# Altium schematic sheet Digital IO Protection.SchDoc: Digital IO Protection
size B; DrawnBy: Jasper Yun; SheetNumber: 6; SheetTotal: 11; Competition: SAC 2021; Subteam: Avionics; University: McGill University; Location: Montreal, Quebec; Project: Avionics Project Name; MRT: McGill Rocket Team
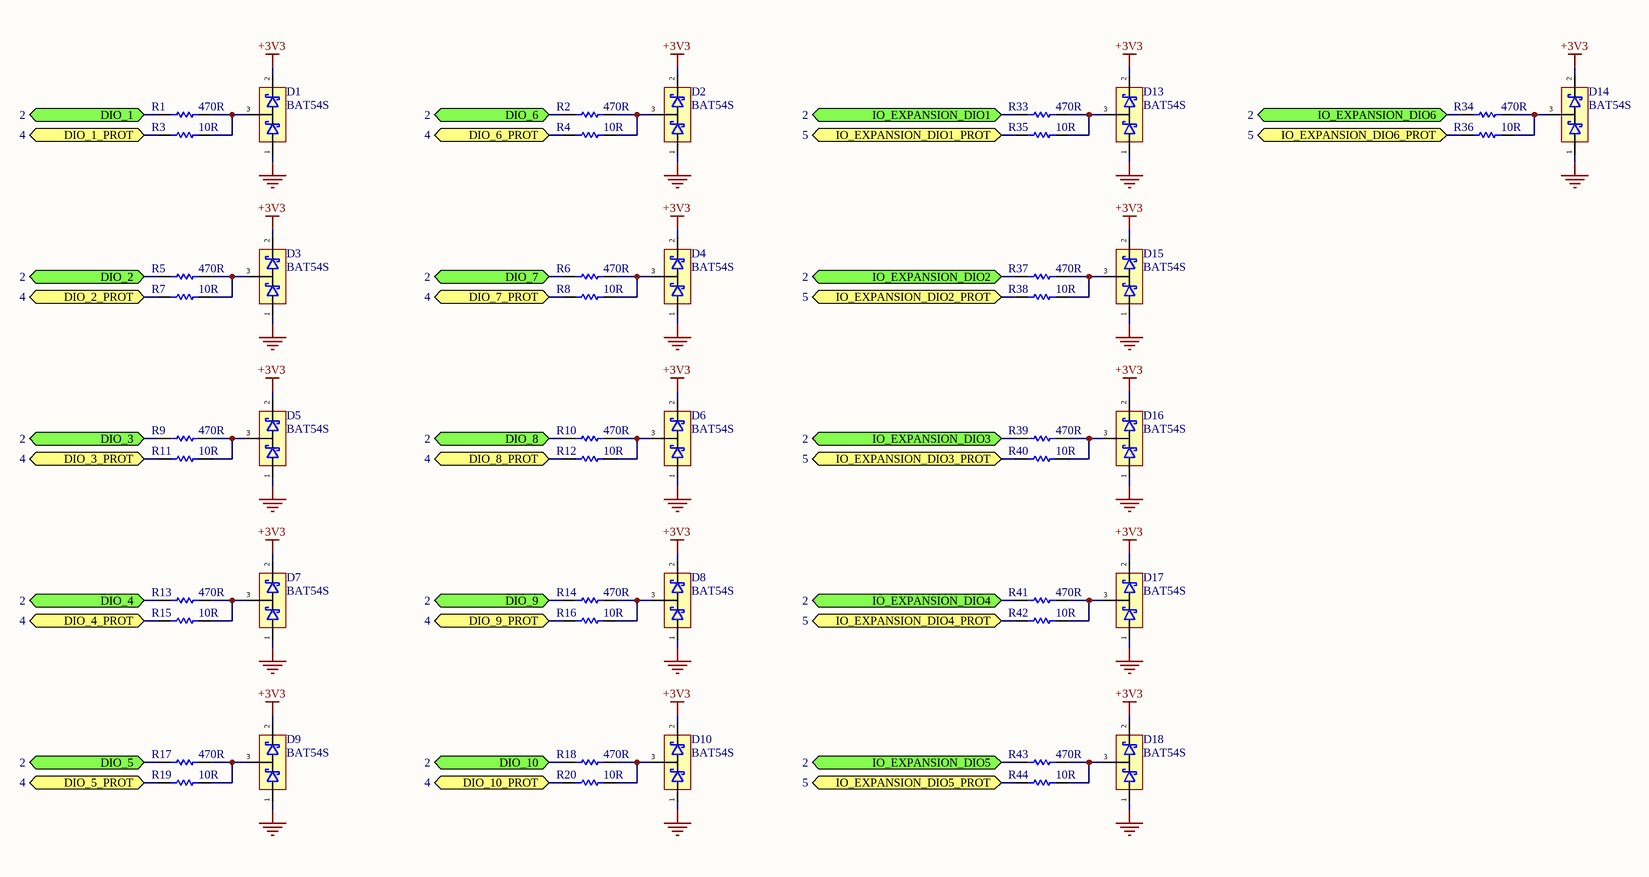
[diagram p0: Digital IO Protection.SchDoc]

## Parts
D1  BAT54S  [SOT23-3]
D2  BAT54S  [SOT23-3]
D3  BAT54S  [SOT23-3]
D4  BAT54S  [SOT23-3]
D5  BAT54S  [SOT23-3]
D6  BAT54S  [SOT23-3]
D7  BAT54S  [SOT23-3]
D8  BAT54S  [SOT23-3]
D9  BAT54S  [SOT23-3]
D10  BAT54S  [SOT23-3]
D13  BAT54S  [SOT23-3]
D14  BAT54S  [SOT23-3]
D15  BAT54S  [SOT23-3]
D16  BAT54S  [SOT23-3]
D17  BAT54S  [SOT23-3]
D18  BAT54S  [SOT23-3]
R1  470R  [0805 RES]
R2  470R  [0805 RES]
R3  10R  [0603 RES]
R4  10R  [0603 RES]
R5  470R  [0805 RES]
R6  470R  [0805 RES]
R7  10R  [0603 RES]
R8  10R  [0603 RES]
R9  470R  [0805 RES]
R10  470R  [0805 RES]
R11  10R  [0603 RES]
R12  10R  [0603 RES]
R13  470R  [0805 RES]
R14  470R  [0805 RES]
R15  10R  [0603 RES]
R16  10R  [0603 RES]
R17  470R  [0805 RES]
R18  470R  [0805 RES]
R19  10R  [0603 RES]
R20  10R  [0603 RES]
R33  470R  [0805 RES]
R34  470R  [0805 RES]
R35  10R  [0603 RES]
R36  10R  [0603 RES]
R37  470R  [0805 RES]
R38  10R  [0603 RES]
R39  470R  [0805 RES]
R40  10R  [0603 RES]
R41  470R  [0805 RES]
R42  10R  [0603 RES]
R43  470R  [0805 RES]
R44  10R  [0603 RES]

## Ports
DIO_1 (bidir, see 2), DIO_1_PROT (bidir, see 4), DIO_2 (bidir, see 2), DIO_2_PROT (bidir, see 4), DIO_3 (bidir, see 2), DIO_3_PROT (bidir, see 4), DIO_4 (bidir, see 2), DIO_4_PROT (bidir, see 4), DIO_5 (bidir, see 2), DIO_5_PROT (bidir, see 4), DIO_6 (bidir, see 2), DIO_6_PROT (bidir, see 4), DIO_7 (bidir, see 2), DIO_7_PROT (bidir, see 4), DIO_8 (bidir, see 2), DIO_8_PROT (bidir, see 4), DIO_9 (bidir, see 2), DIO_9_PROT (bidir, see 4), DIO_10 (bidir, see 2), DIO_10_PROT (bidir, see 4), IO_EXPANSION_DIO1 (bidir, see 2), IO_EXPANSION_DIO1_PROT (bidir, see 5), IO_EXPANSION_DIO2 (bidir, see 2), IO_EXPANSION_DIO2_PROT (bidir, see 5), IO_EXPANSION_DIO3 (bidir, see 2), IO_EXPANSION_DIO3_PROT (bidir, see 5), IO_EXPANSION_DIO4 (bidir, see 2), IO_EXPANSION_DIO4_PROT (bidir, see 5), IO_EXPANSION_DIO5 (bidir, see 2), IO_EXPANSION_DIO5_PROT (bidir, see 5), IO_EXPANSION_DIO6 (bidir, see 2), IO_EXPANSION_DIO6_PROT (bidir, see 5)

## Nets
+3V3: D1.2 D2.2 D3.2 D4.2 D5.2 D6.2 D7.2 D8.2 D9.2 D10.2 D13.2 D14.2 D15.2 D16.2 D17.2 D18.2
GND: D1.1 D2.1 D3.1 D4.1 D5.1 D6.1 D7.1 D8.1 D9.1 D10.1 D13.1 D14.1 D15.1 D16.1 D17.1 D18.1
DIO_1: R1.1 ; port DIO_1
DIO_1_PROT: R3.1 ; port DIO_1_PROT
DIO_2: R5.1 ; port DIO_2
DIO_2_PROT: R7.1 ; port DIO_2_PROT
DIO_3: R9.1 ; port DIO_3
DIO_3_PROT: R11.1 ; port DIO_3_PROT
DIO_4: R13.1 ; port DIO_4
DIO_4_PROT: R15.1 ; port DIO_4_PROT
DIO_5: R17.1 ; port DIO_5
DIO_5_PROT: R19.1 ; port DIO_5_PROT
DIO_6: R2.1 ; port DIO_6
DIO_6_PROT: R4.1 ; port DIO_6_PROT
DIO_7: R6.1 ; port DIO_7
DIO_7_PROT: R8.1 ; port DIO_7_PROT
DIO_8: R10.1 ; port DIO_8
DIO_8_PROT: R12.1 ; port DIO_8_PROT
DIO_9: R14.1 ; port DIO_9
DIO_9_PROT: R16.1 ; port DIO_9_PROT
DIO_10: R18.1 ; port DIO_10
DIO_10_PROT: R20.1 ; port DIO_10_PROT
IO_EXPANSION_DIO1: R33.1 ; port IO_EXPANSION_DIO1
IO_EXPANSION_DIO1_PROT: R35.1 ; port IO_EXPANSION_DIO1_PROT
IO_EXPANSION_DIO2: R37.1 ; port IO_EXPANSION_DIO2
IO_EXPANSION_DIO2_PROT: R38.1 ; port IO_EXPANSION_DIO2_PROT
IO_EXPANSION_DIO3: R39.1 ; port IO_EXPANSION_DIO3
IO_EXPANSION_DIO3_PROT: R40.1 ; port IO_EXPANSION_DIO3_PROT
IO_EXPANSION_DIO4: R41.1 ; port IO_EXPANSION_DIO4
IO_EXPANSION_DIO4_PROT: R42.1 ; port IO_EXPANSION_DIO4_PROT
IO_EXPANSION_DIO5: R43.1 ; port IO_EXPANSION_DIO5
IO_EXPANSION_DIO5_PROT: R44.1 ; port IO_EXPANSION_DIO5_PROT
IO_EXPANSION_DIO6: R34.1 ; port IO_EXPANSION_DIO6
IO_EXPANSION_DIO6_PROT: R36.1 ; port IO_EXPANSION_DIO6_PROT
NetD1_3: D1.3 R1.2 R3.2
NetD2_3: D2.3 R2.2 R4.2
NetD3_3: D3.3 R5.2 R7.2
NetD4_3: D4.3 R6.2 R8.2
NetD5_3: D5.3 R9.2 R11.2
NetD6_3: D6.3 R10.2 R12.2
NetD7_3: D7.3 R13.2 R15.2
NetD8_3: D8.3 R14.2 R16.2
NetD9_3: D9.3 R17.2 R19.2
NetD10_3: D10.3 R18.2 R20.2
NetD13_3: D13.3 R33.2 R35.2
NetD14_3: D14.3 R34.2 R36.2
NetD15_3: D15.3 R37.2 R38.2
NetD16_3: D16.3 R39.2 R40.2
NetD17_3: D17.3 R41.2 R42.2
NetD18_3: D18.3 R43.2 R44.2

## Notes on the sheet
- Title
- Size:
- Date:
- B
- Revision:
- Time:
- Drawn By:
- Sheet
- of
- File:

## Library data of the parts
D1-D10 D13-D18 = Schottky Diode Array BAT54S: Rectifier Diode Small Signal Schottky 40V 0.3A 5ns 3-Pin SOT-23 T/R; Manufacturer: STMicroelectronics; Manufacturer Part Number: BAT54SFILM; Forward Current: 300mA; Peak Non-Repetitive Surge Current: 1A; Forward Voltage: 900mV; Max Reverse Current: 100uA; Max Reverse Leakage Current: 1uA; Element Configuration: Single; Voltage Rating (DC): 30V; Supplier 1: Digi-Key; RoHS: Yes; Category: Rectifier Diodes; Stock 1: 2760; Pricing 1: 1=0.34000, 10=0.27800, 100=0.14730, 500=0.09694, 1000=0.06592 (USD); Mount: Surface Mount; Case/Package: SOT-23; Number of Pins: 3; Weight: 0.1lb; Min Operating Temperature: -40°C; Max Operating Temperature: 150°C; Reverse Recovery Time: 5ns; Max Repetitive Reverse Voltage (Vrrm): 40V; Packaging: Tape and Reel; Package Quantity: 3000; Average Rectified Current: 300mA; Max Forward Surge Current (Ifsm): 1A; Max Reverse Voltage (DC): 40V; Max Surge Current: 1A; Recovery Time: 5ns; Termination: SMD/SMT; Current Rating: 300mA; Length: 2.9mm; Width: 3.05mm; Height: 0.95mm; Radiation Hardening: No; REACH SVHC: No SVHC; RoHS Compliant: Yes; Lead Free: Lead Free; ComponentLink1URL: https://datasheet.ciiva.com/1200/1689724-1200683.pdf?src-supplier=Farnell; ComponentLink1Description: https://datasheet.ciiva.com/1200/1689724-1200683.pdf?src-supplier=Farnell; ComponentLink2URL: https://datasheet.ciiva.com/1177/1689724-1177974.pdf?src-supplier=Element14; ComponentLink2Description: https://datasheet.ciiva.com/1177/1689724-1177974.pdf?src-supplier=Element14; ComponentLink3URL: https://datasheet.ciiva.com/1200/cd00001322-1200682.pdf?src-supplier=Farnell; ComponentLink3Description: https://datasheet.ciiva.com/1200/cd00001322-1200682.pdf?src-supplier=Farnell; ComponentLink4URL: https://datasheet.ciiva.com/14168/cd00001322-14168028.pdf?src-supplier=Distrelec; ComponentLink4Description: https://datasheet.ciiva.com/14168/cd00001322-14168028.pdf?src-supplier=Distrelec; ComponentLink5URL: https://datasheet.ciiva.com/905/cd00001322-905882.pdf?src-supplier=Digi-Key; ComponentLink5Description: https://datasheet.ciiva.com/905/cd00001322-905882.pdf?src-supplier=Digi-Key; ComponentLink6URL: https://datasheet.ciiva.com/905/cd00001322-905881.pdf?src-supplier=Digi-Key; ComponentLink6Description: https://datasheet.ciiva.com/905/cd00001322-905881.pdf?src-supplier=Digi-Key; ComponentLink7URL: https://datasheet.ciiva.com/905/cd00001322-905883.pdf?src-supplier=Digi-Key; ComponentLink7Description: https://datasheet.ciiva.com/905/cd00001322-905883.pdf?src-supplier=Digi-Key; ComponentLink8URL: https://datasheet.ciiva.com/1177/1689724-1177973.pdf?src-supplier=Element14; ComponentLink8Description: https://datasheet.ciiva.com/1177/1689724-1177973.pdf?src-supplier=Element14; Supplier Part Number 1: 497-2522-1-ND
R1-R20 R33-R44 = Res1: Published: 8-Jun-2000; LatestRevisionDate: 17-Jul-2002; LatestRevisionNote: Re-released for DXP Platform.; PackageReference: AXIAL-0.3; Publisher: Altium Limited; PackageDescription: Axial Device, Thru-Hole; 2 Leads; 0.3 in Pin Spacing
  R1 R2 R5 R6 R9 R10 R13 R14 R17 R18 R33 R34 R37 R39 R41 R43: Value: 470R
  R3 R4 R7 R8 R11 R12 R15 R16 R19 R20 R35 R36 R38 R40 R42 R44: Value: 10R